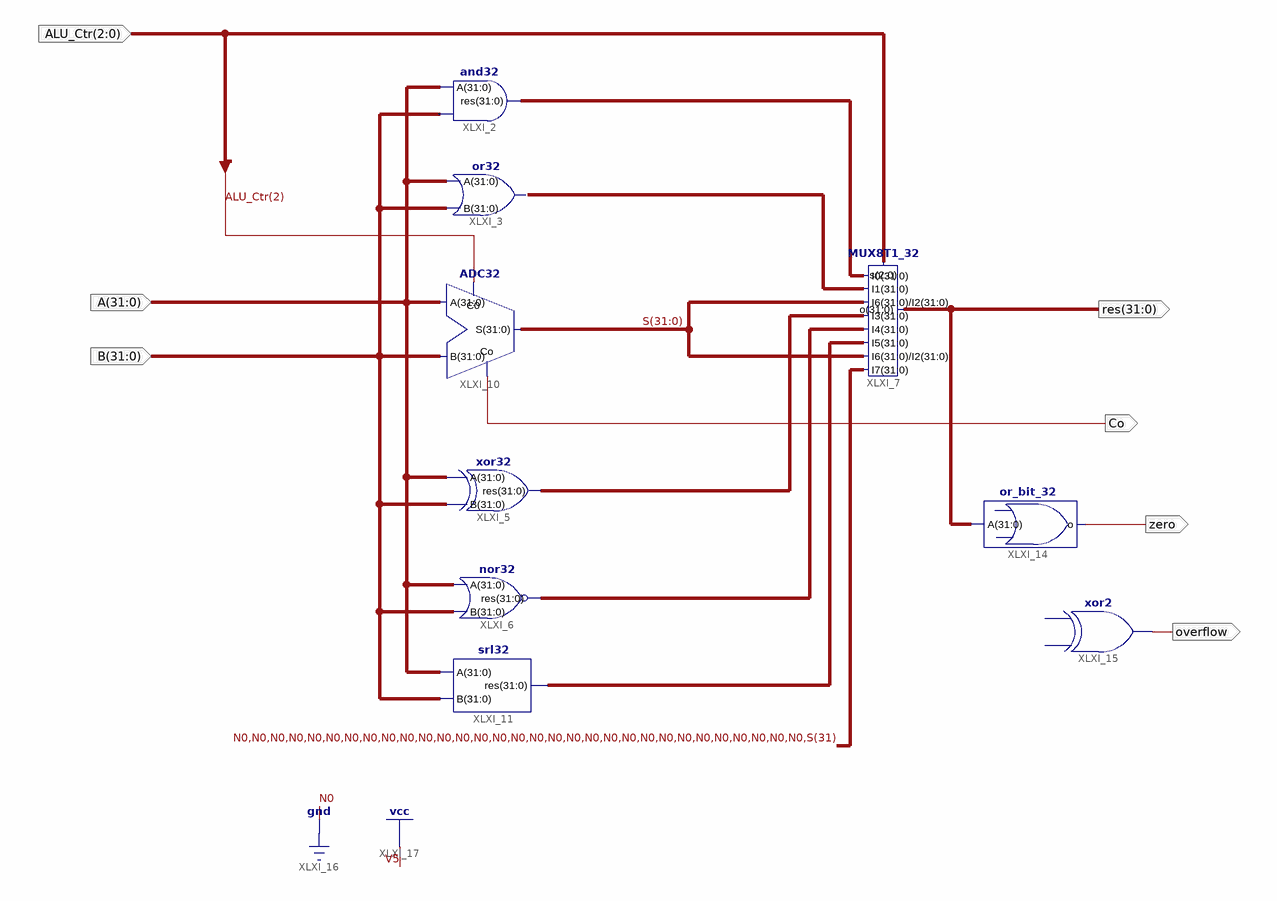
[diagram p0: schematic sheet 1]
// Xilinx ISE schematic alu.sch (kintex7) as structural Verilog: 9 symbols, 7 ports
module alu (
  input  [31:0] B,
  input  [2:0] ALU_Ctr,
  input  [31:0] A,
  output zero,
  output overflow,
  output [31:0] res,
  output Co
);

  wire [31:0] S, XLXN_5, XLXN_6, XLXN_7, XLXN_10, XLXN_11;

  and32 XLXI_2 (.res(XLXN_5), .A(A), .B(B));
  or32 XLXI_3 (.res(XLXN_6), .A(A), .B(B));
  xor32 XLXI_5 (.A(A), .B(B), .res(XLXN_7));
  nor32 XLXI_6 (.res(XLXN_10), .A(A), .B(B));
  MUX8T1_32 XLXI_7 (
    .s(ALU_Ctr), .I7({{31{1'b0}}, S[31]}), .I6(S), .I5(XLXN_11), .I4(XLXN_10), .I3(XLXN_7), .I2(S),
    .I1(XLXN_6), .I0(XLXN_5), .o(res));
  ADC32 XLXI_10 (.A(A), .C0(ALU_Ctr[2]), .S(S), .B(B), .Co(Co));
  srl32 XLXI_11 (.A(A), .B(B), .res(XLXN_11));
  or_bit_32 XLXI_14 (.o(zero), .A(res));
  // xor2 XLXI_15 has open pins: I0=open, I1=open, O=overflow
endmodule
